# EAGLE design InterfaceBoard (EAGLE 9.6.2)
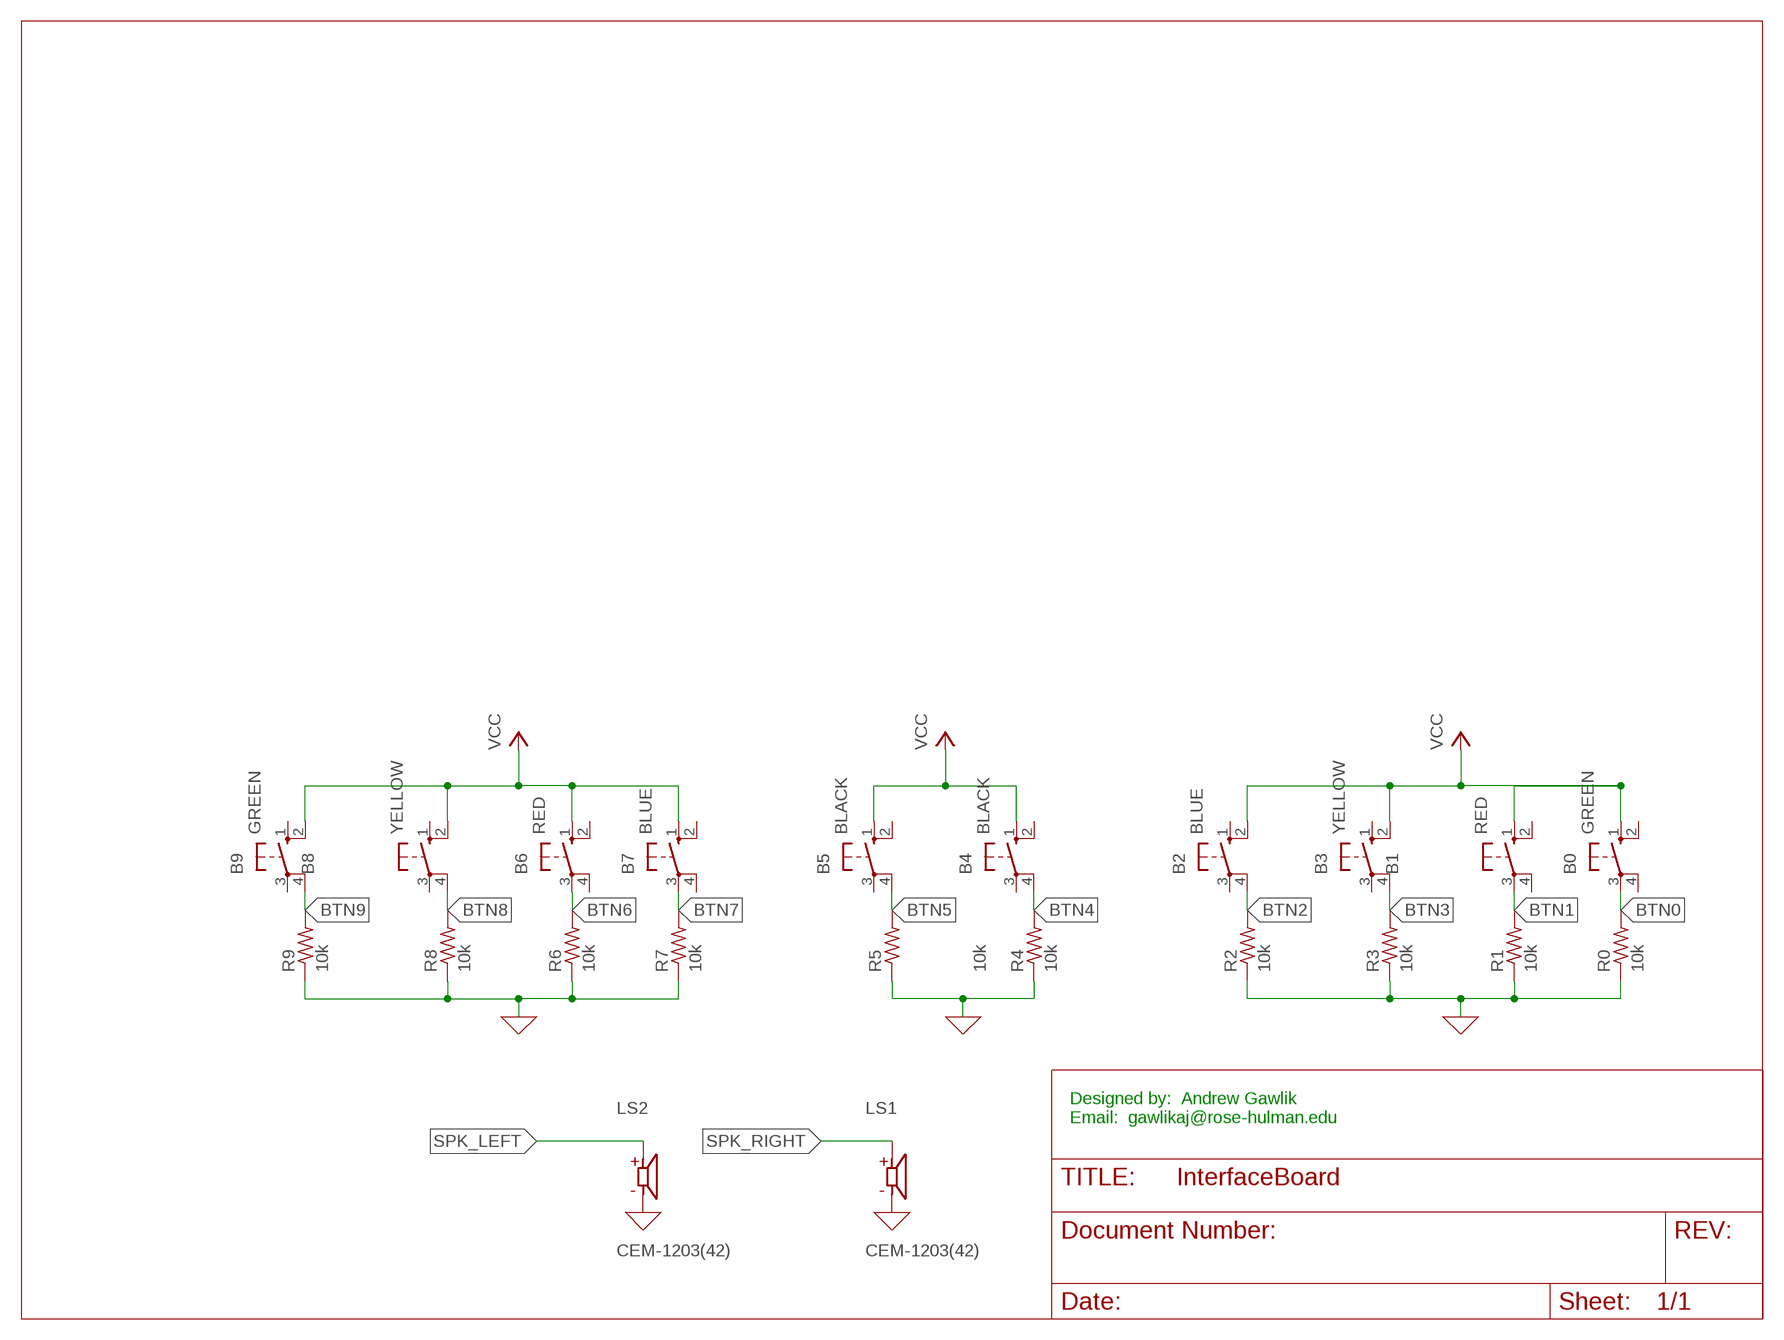
[diagram p0: schematic, sheet 1]

## Parts
B0  GREEN  10-XX  [B3F-10XX]
B1  RED  10-XX  [B3F-10XX]
B2  BLUE  10-XX  [B3F-10XX]
B3  YELLOW  10-XX  [B3F-10XX]
B4  BLACK  10-XX  [B3F-10XX]
B5  BLACK  10-XX  [B3F-10XX]
B6  RED  10-XX  [B3F-10XX]
B7  BLUE  10-XX  [B3F-10XX]
B8  YELLOW  10-XX  [B3F-10XX]
B9  GREEN  10-XX  [B3F-10XX]
LS1  CEM-1203(42)  [CUI_CEM-1203(42)]
LS2  CEM-1203(42)  [CUI_CEM-1203(42)]
R0  10k  R-US_0204/5  [0204/5]
R1  10k  R-US_0204/5  [0204/5]
R2  10k  R-US_0204/5  [0204/5]
R3  10k  R-US_0204/5  [0204/5]
R4  10k  R-US_0204/5  [0204/5]
R5  10k  R-US_0204/5  [0204/5]
R6  10k  R-US_0204/5  [0204/5]
R7  10k  R-US_0204/5  [0204/5]
R8  10k  R-US_0204/5  [0204/5]
R9  10k  R-US_0204/5  [0204/5]

## Nets
0: LS1.N LS2.N R0.1 R1.1 R2.1 R3.1 R4.1 R5.1 R6.1 R7.1 R8.1 R9.1 ; supply symbol labelled GND
BTN0: B0.3(P) R0.2
BTN1: B1.3(P) R1.2
BTN2: B2.4(P1) R2.2
BTN3: B3.4(P1) R3.2
BTN4: B4.4(P1) R4.2
BTN5: B5.4(P1) R5.2
BTN6: B6.3(P) R6.2
BTN7: B7.3(P) R7.2
BTN8: B8.4(P1) R8.2
BTN9: B9.4(P1) R9.2
SPK_LEFT: LS2.P
SPK_RIGHT: LS1.P
VCC: B0.1(S) B1.1(S) B2.2(S1) B3.2(S1) B4.1(S) B5.1(S) B6.1(S) B7.1(S) B8.2(S1) B9.2(S1)
Unconnected: B0.2(S1) B0.4(P1) B1.2(S1) B1.4(P1) B2.1(S) B2.3(P) B3.1(S) B3.3(P) B4.2(S1) B4.3(P) B5.2(S1) B5.3(P) B6.2(S1) B6.4(P1) B7.2(S1) B7.4(P1) B8.1(S) B8.3(P) B9.1(S) B9.3(P)

## Notes on the sheet
- Designed by:  Andrew Gawlik
  Email:  gawlikaj@rose-hulman.edu

## Library data of the parts
B0 B1-B9 = switch-omron:10-XX: OMRON SWITCH; MPN: B3F-1000; OC_FARNELL: 176432; OC_NEWARK: 36M3542
LS1 LS2 = CEM-1203_42_:CEM-1203(42): 12 mm, 3.5 V, 85 dB, Through Hole, Magnetic Audio Transducer Buzzer Check prices <https://pricing.snapeda.com/parts/CEM-1203%2842%29/CUI%20Devices/view-part?ref=eda>; AVAILABILITY: Good; CUI_PURCHASE_URL: https://www.cuidevices.com/product/audio/buzzers/audio-transducers/cem-1203(42)?utm_source=snapeda.com&utm_medium=referral&utm_campaign=snapedaBOM; DESCRIPTION: 12 mm, 3.5 V, 85 dB, Through Hole, Magnetic Audio Transducer Buzzer; MF: CUI Devices; MP: CEM-1203(42); PACKAGE: TO-220 CUI Inc.; PRICE: None; PURCHASE-URL: https://pricing.snapeda.com/search/part/CEM-1203(42)/?ref=eda
R0 R1-R9 = rcl:R-US_: RESISTOR, American symbol; SPICEPREFIX: R

## Board
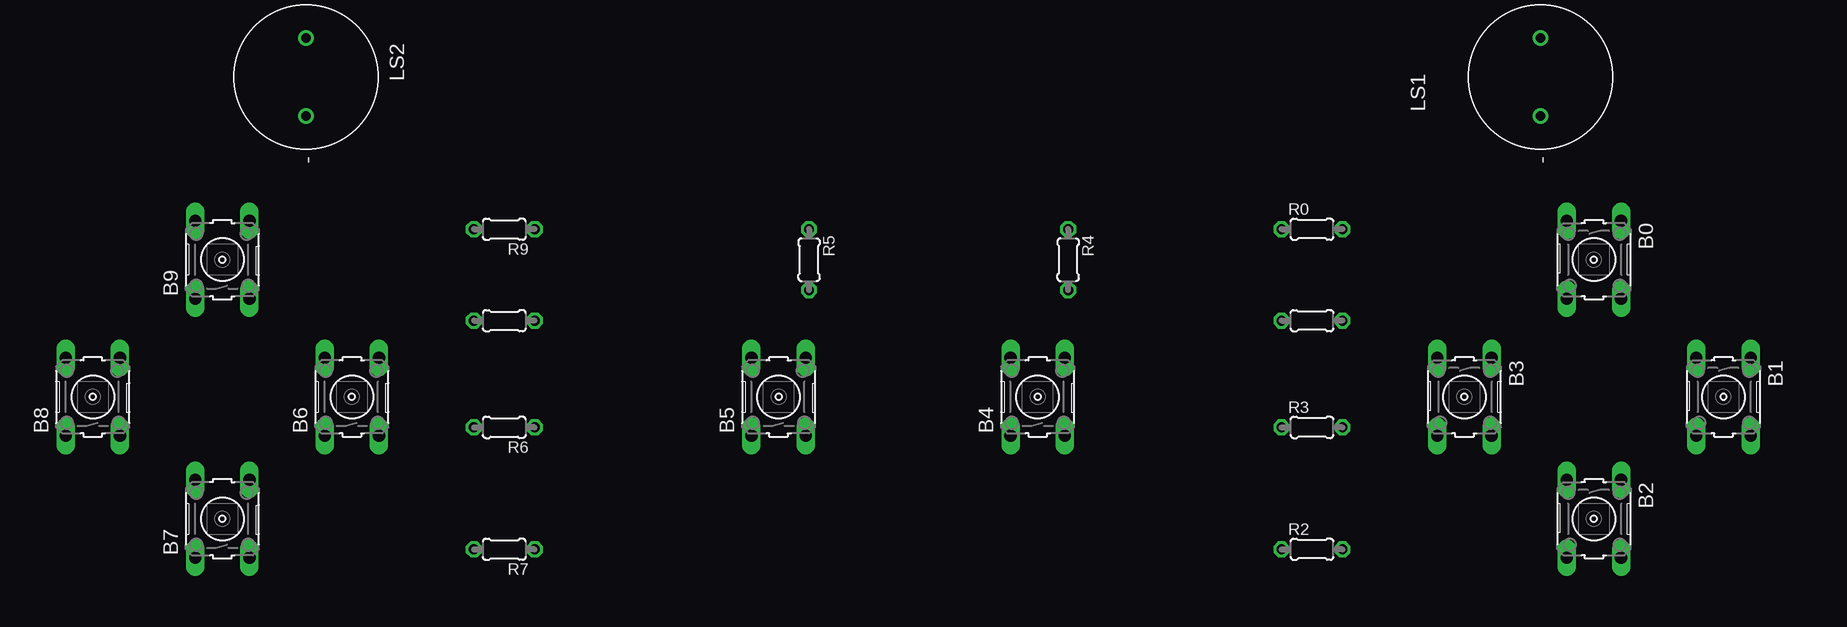
[diagram p1: board, top side]
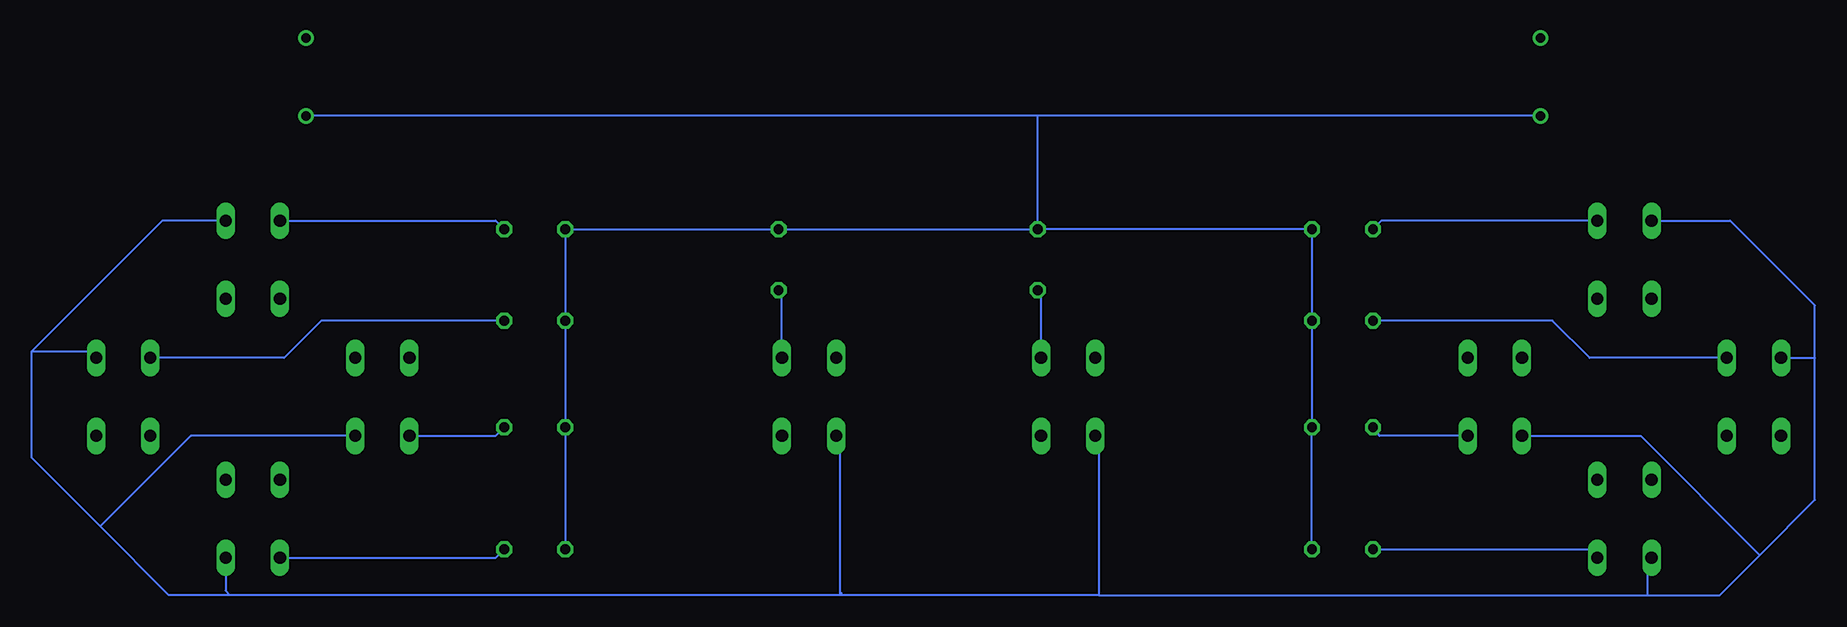
[diagram p2: board, bottom side, seen from below]

No outline drawn. Coordinates in mm, seen from the top.
Copper layers (1*16): Top 0.035mm / dielectric 1.5mm / Bottom 0.035mm
Design rules "default": minimum track width 6mil, minimum drill 0.35mm, track to track 6mil, track to pad 6mil, pad to pad 6mil, via to via 6mil, smd to smd 6mil, copper to edge 40mil, drill to drill 6mil, minimum pad ring 10mil, minimum via ring 8mil, stop-mask expansion 4mil, vias tented up to drill 0mil, thermal gap 10mil

### Footprints (pad centres in the part's own frame; a part is rotated, then mirrored left to right if it is on the bottom)
B3F-10XX = drill 1.016 long: 1 -3.251,2.261; 2 3.251,2.261; 3 -3.251,-2.261; 4 3.251,-2.261
CUI_CEM-1203(42) = drill 0.8: N 3.25,0; P -3.25,0
0204/5 = drill 0.813 octagon: 1 -2.54,0; 2 2.54,0

### Placement (x,y rotation side)
B0  130.18,29.21 270 top
B1  140.97,17.78 270 top
B2  130.18,7.62 270 top
B3  119.38,17.78 270 top
B4  83.82,17.78 90 top
B5  62.23,17.78 90 top
B6  26.67,17.78 90 top
B7  15.88,7.62 90 top
B8  5.08,17.78 90 top
B9  15.88,29.21 90 top
LS1  125.73,44.45 270 top
LS2  22.86,44.45 270 top
R0  106.68,31.75 0 top
R1  106.68,24.13 0 top
R2  106.68,5.08 0 top
R3  106.68,15.24 0 top
R4  86.36,29.21 270 top
R5  64.77,29.21 270 top
R6  39.37,15.24 180 top
R7  39.37,5.08 180 top
R8  39.37,24.13 180 top
R9  39.37,31.75 180 top

### Tracks (layer width: path | path; a pad name or v marks a point on that pad's centre or on a via)
0
  Bottom 0.152: R2.1 R3.1 R1.1 R0.1 R4.1 R5.1 | R5.1 R9.1 R8.1 R6.1 R7.1 | LS2.N 64.77,41.2 | 64.77,41.2 LS1.N | R5.1 64.77,41.2
BTN0
  Bottom 0.152: B0.3 109.93,32.46 R0.2
BTN1
  Bottom 0.152: B1.3 127.56,21.03 124.46,24.13 R1.2
BTN2
  Bottom 0.152: 109.55,4.75 R2.2 109.93,4.37 B2.4
BTN3
  Bottom 0.152: B3.4 109.93,14.53 R3.2
BTN4
  Bottom 0.152: R4.2 86.08,26.39 B4.4
BTN5
  Bottom 0.152: 64.92,26.66 R5.2 64.49,26.39 B5.4
BTN6
  Bottom 0.152: B6.3 36.27,14.53 R6.2
BTN7
  Bottom 0.152: B7.3 18.85,5.08 R7.2
BTN8
  Bottom 0.152: B8.4 18.77,21.03 21.87,24.13 R8.2
BTN9
  Bottom 0.152: B9.4 36.12,32.46 R9.2
VCC
  Bottom 0.152: 148.59,21.59 148.59,12.7 142.88,6.99 | 148.59,21.59 143.79,21.59 B1.1 | B0.1 137.72,32.46 148.59,21.59 | 142.88,6.99 137.16,1.27 132.08,1.27 | 81.28,1.27 132.08,1.27 | 81.13,1.42 81.28,1.27 | B5.1 59.69,14.49 59.69,1.27 | B4.1 81.28,14.25 81.28,1.27 | 59.69,1.27 81.28,1.27 | B9.2 7.06,32.46 0,25.4 0,21.03 | B8.2 0,21.03 | B3.2 135.33,14.53 142.88,6.99 | 4.6,4.6 0,9.2 0,21.03 | 4.6,4.6 14.53,14.53 B6.1 | 4.6,4.6 7.92,1.27 13.97,1.27 | 59.69,1.27 13.97,1.27 | B7.1 13.97,4.01 13.97,1.27 | B2.2 132.44,1.63 132.08,1.27

### Text on the board
Document: Designed by: Andrew Gawlik / Email: gawlikaj@rose-hulman.edu